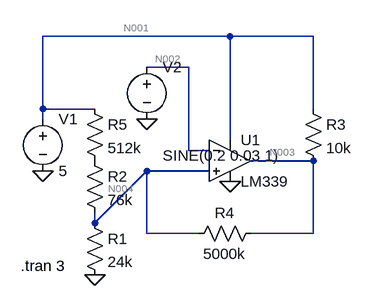
[diagram p0: schematic gysteresis.asc]
gysteresis.asc, the LTspice schematic file:
Version 4
SHEET 1 880 680
WIRE 112 -48 -176 -48
WIRE 240 -48 112 -48
WIRE 48 0 -16 0
WIRE -176 64 -176 -48
WIRE -96 64 -176 64
WIRE 240 64 240 -48
WIRE -176 80 -176 64
WIRE 112 112 112 -48
WIRE 48 128 48 0
WIRE 80 128 48 128
WIRE 240 144 144 144
WIRE 80 160 -16 160
WIRE -96 240 -16 160
WIRE -96 240 -96 224
WIRE -16 256 -16 160
WIRE 64 256 -16 256
WIRE 240 256 240 144
WIRE 240 256 144 256
FLAG -176 160 0
FLAG -96 320 0
FLAG -16 80 0
FLAG 112 176 0
SYMBOL Comparators\\LM339 112 80 R0
SYMATTR InstName U1
SYMBOL res -112 224 R0
SYMATTR InstName R1
SYMATTR Value 24k
SYMBOL res -112 128 R0
SYMATTR InstName R2
SYMATTR Value 76k
SYMBOL voltage -176 64 R0
WINDOW 123 0 0 Left 2
WINDOW 39 0 0 Left 2
SYMATTR InstName V1
SYMATTR Value 5
SYMBOL voltage -16 -16 R0
WINDOW 3 24 152 Left 2
WINDOW 123 24 124 Left 2
WINDOW 39 0 0 Left 2
SYMATTR InstName V2
SYMATTR Value SINE(0.2 0.03 1)
SYMBOL res 224 48 R0
SYMATTR InstName R3
SYMATTR Value 10k
SYMBOL res 160 240 R90
WINDOW 0 0 56 VBottom 2
WINDOW 3 32 56 VTop 2
SYMATTR InstName R4
SYMATTR Value 5000k
SYMBOL res -112 48 R0
SYMATTR InstName R5
SYMATTR Value 512k
TEXT -210 306 Left 2 !.tran 3

The netlist it stands for:
* gysteresis.asc
XU1 N004 N002 N001 0 N003 LM339  ; pins In+ In- V+ V- OUT
R1 N004 0 24k
R2 P001 N004 76k
V1 N001 0 5
V2 N002 0 SINE(0.2 0.03 1)
R3 N001 N003 10k
R4 N003 N004 5000k
R5 N001 P001 512k
.tran 3
.lib LM339.sub
.backanno
.end

* Results of the author's LTspice run, read from the files saved beside the schematic
* Operating Point, zero values left out:
*   V(n001) = 5 V
*   V(n004) = 200 mV
*   V(n002) = 200 mV
*   V(n003) = 934.5 mV
*   V(p001) = 820.4 mV
*   I(R5) = 8.163 µA
*   I(R4) = 146.9 nA
*   I(R3) = 406.6 µA
*   I(R2) = 8.163 µA
*   I(R1) = 8.335 µA
*   I(V2) = 25.01 nA
*   I(V1) = -622.7 µA
*   Ix(u1:1) = -24.97 nA
*   Ix(u1:2) = -25.01 nA
*   Ix(u1:3) = 208 µA
*   Ix(u1:4) = -614.3 µA
*   Ix(u1:5) = 406.4 µA
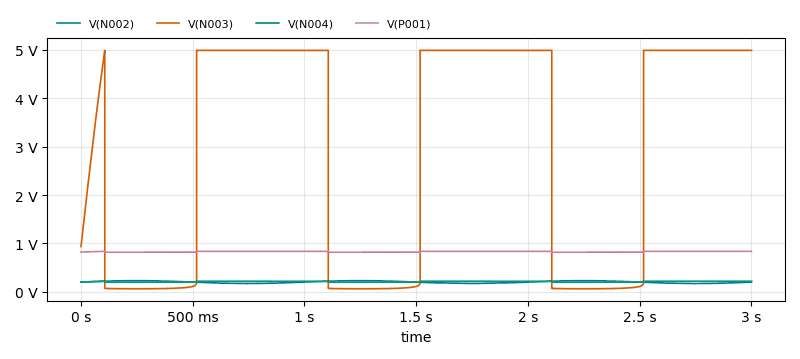
[diagram p1: Transient Analysis of gysteresis.asc, plotted from the saved traces]
* Transient Analysis, 1 run:
*   V(N002): min 170.1 mV, max 229.9 mV, average 200.4 mV, rms 201.5 mV, last 200 mV
*   V(N003): min 61.18 mV, max 4.99 V, average 2.9 V, rms 3.765 V, last 4.99 V
*   V(N004): min 196.3 mV, max 218.7 mV, average 209 mV, rms 209.3 mV, last 218.5 mV
*   V(P001): min 817.1 mV, max 836.7 mV, average 828.2 mV, rms 828.3 mV, last 836.5 mV